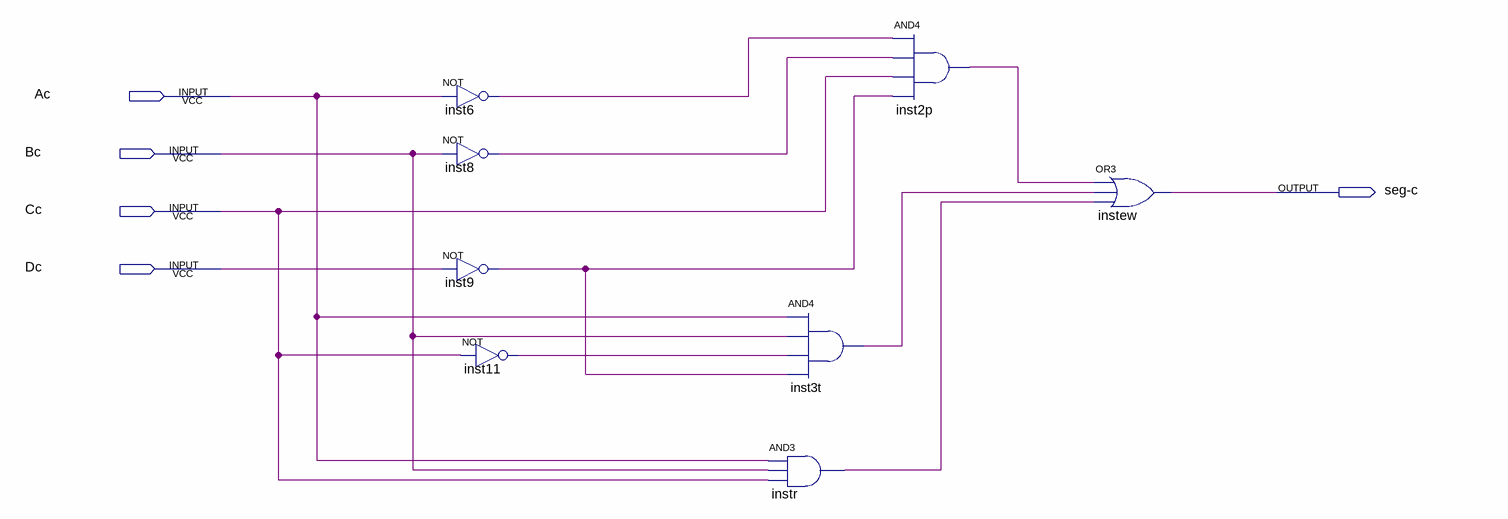
[diagram p0: schematic sheet]
// Quartus schematic segmento_c.bdf as structural Verilog: 8 symbols, 5 pins
module segmento_c (
  input  Ac,
  input  Bc,
  input  Cc,
  input  Dc,
  output \seg-c 
);

  wire inst2p_out, inst3t_out, inst6_out, inst8_out, inst9_out, inst11_out, instr_out;

  not inst6 (inst6_out, Ac);
  not inst8 (inst8_out, Bc);
  not inst9 (inst9_out, Dc);
  not inst11 (inst11_out, Cc);
  and instr (instr_out, Ac, Bc, Cc);
  and inst3t (inst3t_out, Ac, Bc, inst11_out, inst9_out);
  and inst2p (inst2p_out, inst6_out, inst8_out, Cc, inst9_out);
  or instew (\seg-c , inst2p_out, inst3t_out, instr_out);
endmodule
